# EAGLE design ext_m8 (EAGLE 4.13)
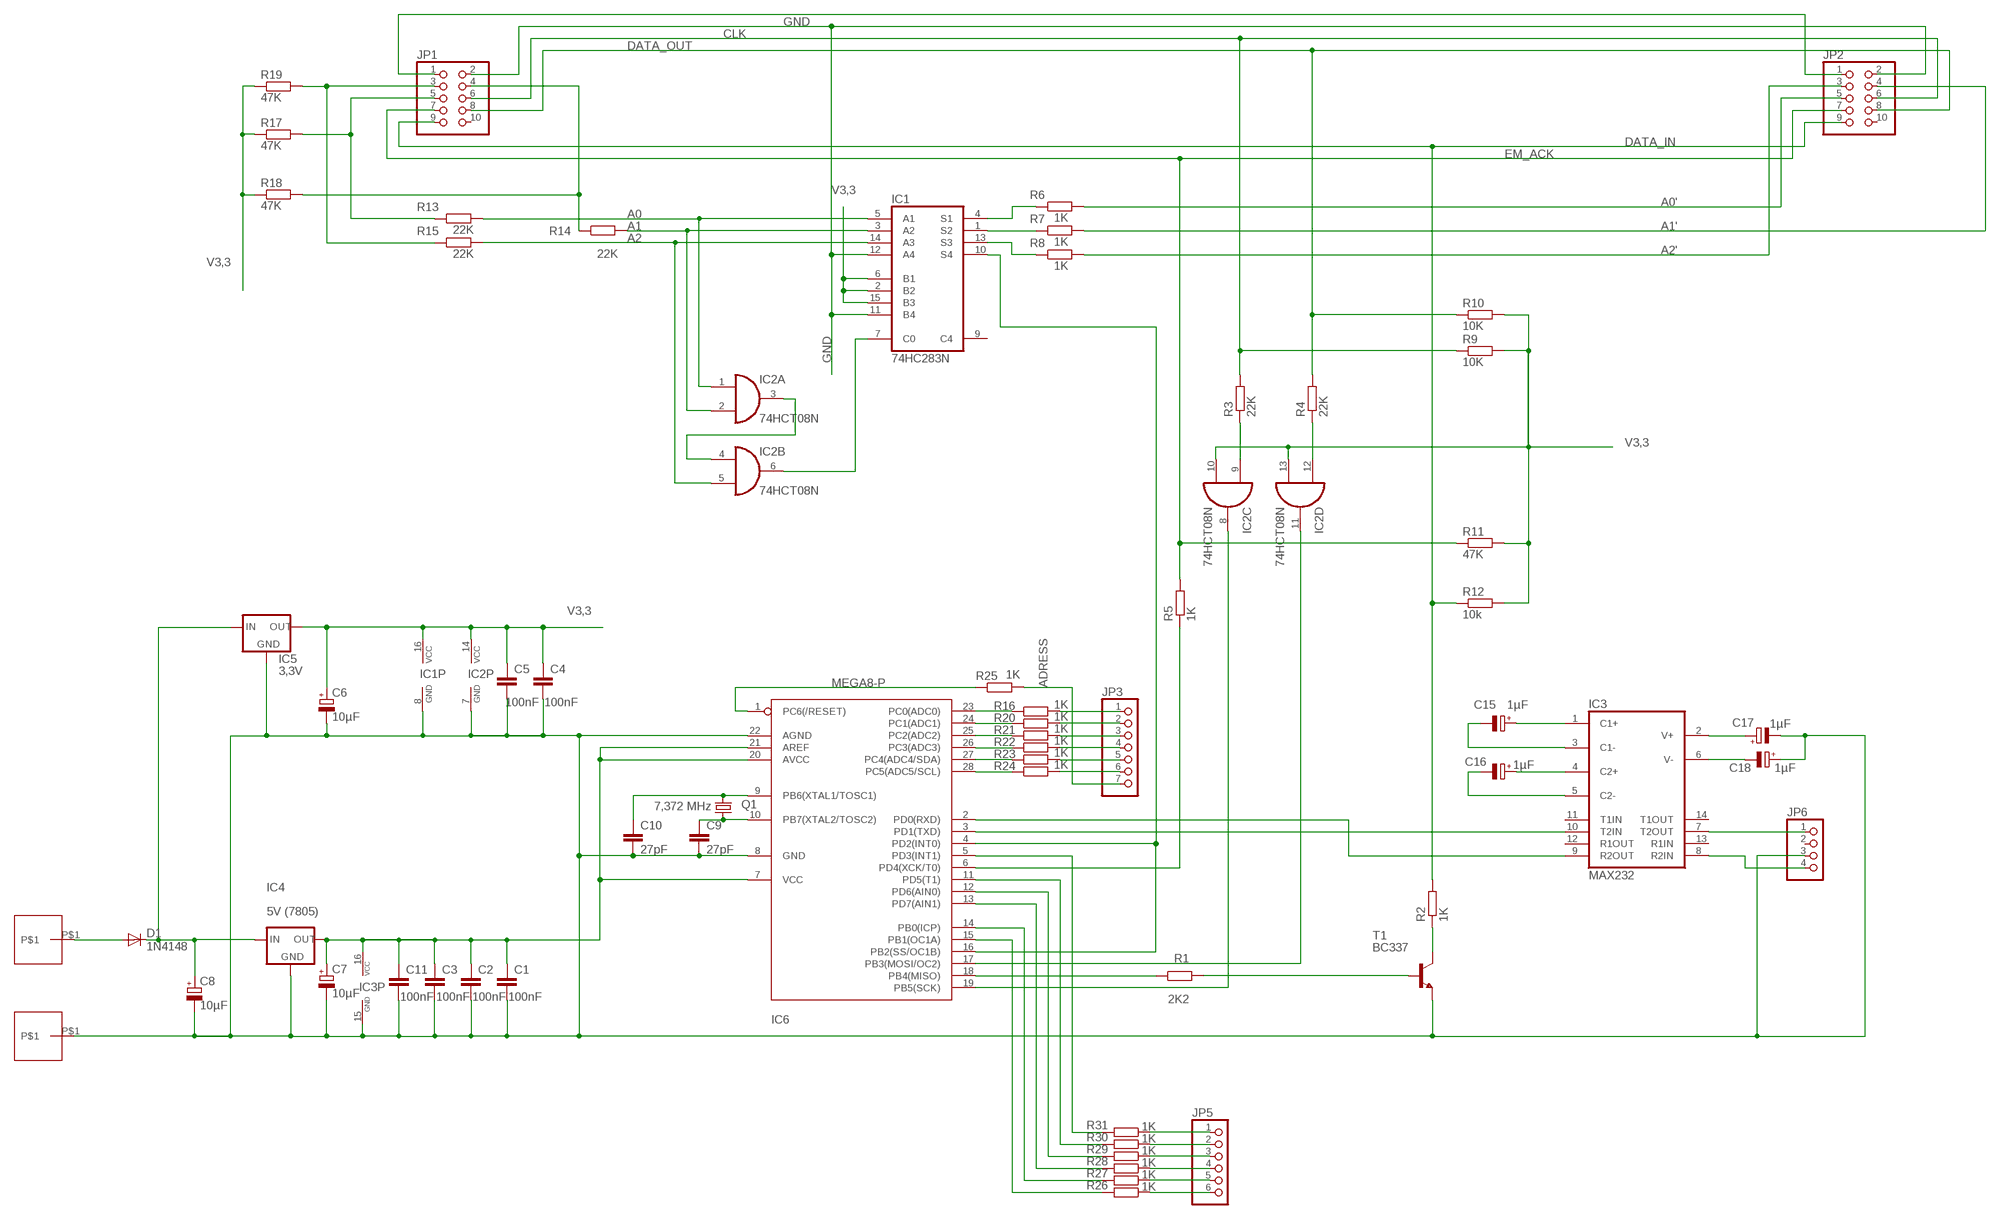
[diagram p0: schematic, sheet 1]

## Parts
C1  100nF  C-EU025-025X050  [C025-025X050]
C2  100nF  C-EU025-025X050  [C025-025X050]
C3  100nF  C-EU025-025X050  [C025-025X050]
C4  100nF  C-EU025-025X050  [C025-025X050]
C5  100nF  C-EU025-025X050  [C025-025X050]
C6  10µF  CPOL-EUE2,5-6E  [E2,5-6E]
C7  10µF  CPOL-EUE2,5-6E  [E2,5-6E]
C8  10µF  CPOL-EUE2,5-6E  [E2,5-6E]
C9  27pF  C-EU025-025X050  [C025-025X050]
C10  27pF  C-EU025-025X050  [C025-025X050]
C11  100nF  C-EU025-025X050  [C025-025X050]
C15  1µF  CPOL-EUE2.5-6  [E2,5-6]
C16  1µF  CPOL-EUE2.5-6  [E2,5-6]
C17  1µF  CPOL-EUE2.5-6  [E2,5-6]
C18  1µF  CPOL-EUE2.5-6  [E2,5-6]
D1  1N4148  [DO35-10]
IC1  74HC283N  74AC283N  [DIL16]
IC2  74HCT08N  74AC08N  [DIL14]
IC3  MAX232  [DIL16]
IC4  5V (7805)  78XXS  [78XXS]
IC5  3,3V  78XXS  [78XXS]
IC6  MEGA8-P  [DIL28-3]
JP1  PINHD-2X5W  [2X05/W]
JP2  PINHD-2X5W  [2X05/W]
JP3  PINHD-1X7  [1X07]
JP5  PINHD-1X6  [1X06]
JP6  PINHD-1X4  [1X04]
PIN1  FT-PIN2  [FT-PIN1]
PIN8  FT-PIN2  [FT-PIN1]
Q1  7,372 MHz  CRYTALHC49U-V  [HC49U-V]
R1  2K2  R-EU_0207/10  [0207/10]
R2  1K  R-EU_0207/10  [0207/10]
R3  22K  R-EU_0207/10  [0207/10]
R4  22K  R-EU_0207/10  [0207/10]
R5  1K  R-EU_0207/10  [0207/10]
R6  1K  R-EU_0207/10  [0207/10]
R7  1K  R-EU_0207/10  [0207/10]
R8  1K  R-EU_0207/10  [0207/10]
R9  10K  R-EU_0207/10  [0207/10]
R10  10K  R-EU_0207/10  [0207/10]
R11  47K  R-EU_0207/10  [0207/10]
R12  10k  R-EU_0207/10  [0207/10]
R13  22K  R-EU_0207/10  [0207/10]
R14  22K  R-EU_0207/10  [0207/10]
R15  22K  R-EU_0207/10  [0207/10]
R16  1K  R-EU_0207/2V  [0207/2V]
R17  47K  R-EU_0207/10  [0207/10]
R18  47K  R-EU_0207/10  [0207/10]
R19  47K  R-EU_0207/10  [0207/10]
R20  1K  R-EU_0207/2V  [0207/2V]
R21  1K  R-EU_0207/2V  [0207/2V]
R22  1K  R-EU_0207/2V  [0207/2V]
R23  1K  R-EU_0207/2V  [0207/2V]
R24  1K  R-EU_0207/2V  [0207/2V]
R25  1K  R-EU_0207/2V  [0207/2V]
R26  1K  R-EU_0207/2V  [0207/2V]
R27  1K  R-EU_0207/2V  [0207/2V]
R28  1K  R-EU_0207/2V  [0207/2V]
R29  1K  R-EU_0207/2V  [0207/2V]
R30  1K  R-EU_0207/2V  [0207/2V]
R31  1K  R-EU_0207/2V  [0207/2V]
T1  BC337  [TO92]

## Nets
A0: IC1.5(A1) IC2.1(A:I0) R13.2
A0': JP2.5 R6.2
A1: IC1.3(A2) IC2.2(A:I1) R14.2
A1': JP2.4 R7.2
A2: IC1.14(A3) IC2.5(B:I1) R15.2
A2': JP2.3 R8.2
ADRESS: IC1.10(S4) IC6.4(PD2(INT0)) IC6.16(PB2(SS/OC1B))
CLK: JP1.6 JP2.6 R3.2 R9.1
DATA_IN: JP1.9 JP2.9 R2.2 R12.1
DATA_OUT: JP1.8 JP2.8 R4.2 R10.1
EM_ACK: JP1.7 JP2.7 R5.2 R11.1
GND: C1.2 C2.2 C3.2 C4.2 C5.2 C6.- C7.- C8.- C9.2 C10.2 C11.2 C17.- C18.+ IC1.8(GND) IC1.11(B4) IC1.12(A4) IC2.7(P:GND) IC3.15(GND) IC4.GND IC5.GND IC6.8(GND) IC6.22(AGND) JP1.2 JP2.2 JP6.3 PIN1.P$1 T1.1(E)
N$1: IC2.3(A:O) IC2.4(B:I0)
N$2: IC6.18(PB4(MISO)) R1.1
N$3: IC1.7(C0) IC2.6(B:O)
N$4: R1.2 T1.2(B)
N$5: R2.1 T1.3(C)
N$6: C8.+ D1.C IC4.IN IC5.IN
N$7: JP1.5 R13.1 R17.2
N$8: IC2.9(C:I0) R3.1
N$9: IC2.12(D:I0) R4.1
N$10: JP1.1 JP2.1
N$11: IC6.6(PD4(XCK/T0)) R5.1
N$12: IC1.4(S1) R6.1
N$13: IC1.1(S2) R7.1
N$14: IC1.13(S3) R8.1
N$15: JP1.4 R14.1 R18.2
N$16: JP1.3 R15.1 R19.2
N$17: IC6.23(PC0(ADC0)) R16.1
N$18: D1.A PIN8.P$1
N$19: IC6.24(PC1(ADC1)) R20.1
N$20: IC6.25(PC2(ADC2)) R21.1
N$21: IC6.26(PC3(ADC3)) R22.1
N$22: IC6.27(PC4(ADC4/SDA)) R23.1
N$23: IC6.28(PC5(ADC5/SCL)) R24.1
N$24: C10.1 IC6.9(PB6(XTAL1/TOSC1)) Q1.2
N$25: C9.1 IC6.10(PB7(XTAL2/TOSC2)) Q1.1
N$26: IC6.15(PB1(OC1A)) R26.2
N$27: IC6.5(PD3(INT1)) R31.2
N$28: IC6.14(PB0(ICP)) R27.2
N$29: IC6.13(PD7(AIN1)) R28.2
N$30: IC6.12(PD6(AIN0)) R29.2
N$31: IC6.11(PD5(T1)) R30.2
N$32: JP3.1 R16.2
N$33: JP3.2 R20.2
N$34: IC6.1(PC6(/RESET)) R25.1
N$35: JP3.3 R21.2
N$36: JP3.4 R22.2
N$37: JP3.5 R23.2
N$38: JP3.6 R24.2
N$39: JP3.7 R25.2
N$40: JP5.6 R26.1
N$41: JP5.5 R27.1
N$42: JP5.4 R28.1
N$43: JP5.3 R29.1
N$44: JP5.2 R30.1
N$45: JP5.1 R31.1
N$46: C15.- IC3.3(C1-)
N$47: C15.+ IC3.1(C1+)
N$48: C16.- IC3.5(C2-)
N$49: C16.+ IC3.4(C2+)
N$50: C17.+ IC3.2(V+)
N$51: C18.- IC3.6(V-)
N$52: IC3.7(T2OUT) JP6.1
N$53: IC3.8(R2IN) JP6.4
N$54: IC2.8(C:O) IC6.19(PB5(SCK))
N$55: IC2.11(D:O) IC6.17(PB3(MOSI/OC2))
RXD: IC3.9(R2OUT) IC6.2(PD0(RXD))
TXD: IC3.10(T2IN) IC6.3(PD1(TXD))
V3,3: C4.1 C5.1 C6.+ IC1.2(B2) IC1.6(B1) IC1.15(B3) IC1.16(VCC) IC2.10(C:I1) IC2.13(D:I1) IC2.14(P:VCC) IC5.OUT R9.2 R10.2 R11.2 R12.2 R17.1 R18.1 R19.1
VCC: C1.1 C2.1 C3.1 C7.+ C11.1 IC3.16(VCC) IC4.OUT IC6.7(VCC) IC6.20(AVCC) IC6.21(AREF)
Unconnected: IC1.9(C4) IC3.11(T1IN) IC3.12(R1OUT) IC3.13(R1IN) IC3.14(T1OUT) JP1.10 JP2.10 JP6.2

## Library data of the parts
C1-C5 C9-C11 = rcl:C-EU: CAPACITOR, European symbol
C6-C8 C15-C18 = rcl:CPOL-EU: POLARIZED CAPACITOR, European symbol
D1 = diode:1N4148: DIODE high speed (Philips)
IC1 = 74xx-eu:74*283: 4-bit binary FULL ADDER, fast carry
IC2 = 74xx-eu:74*08: Quad 2-input AND gate
IC3 = maxim:MAX232: RS232 TRANSEIVER
IC4 IC5 = v-reg:78XXS: VOLTAGE REGULATOR
IC6 = atmel:MEGA8-P: MICROCONTROLLER 8 Kbytes FLASH 1 kbytes SRAM 512 bytes EEPROM USART 4-channel 10 bit ADC 2-channel 8 bit ADC
JP1 JP2 = pinhead:PINHD-2X5: PIN HEADER
JP3 = pinhead:PINHD-1X7: PIN HEADER
JP5 = pinhead:PINHD-1X6: PIN HEADER
JP6 = pinhead:PINHD-1X4: PIN HEADER
PIN1 PIN8 = thomas:FT-PIN
Q1 = crystal:CRYTAL: CRYSTAL
R1-R31 = rcl:R-EU_: RESISTOR, European symbol
T1 = transistor:BC337: NPN TRANSISTOR

## Board
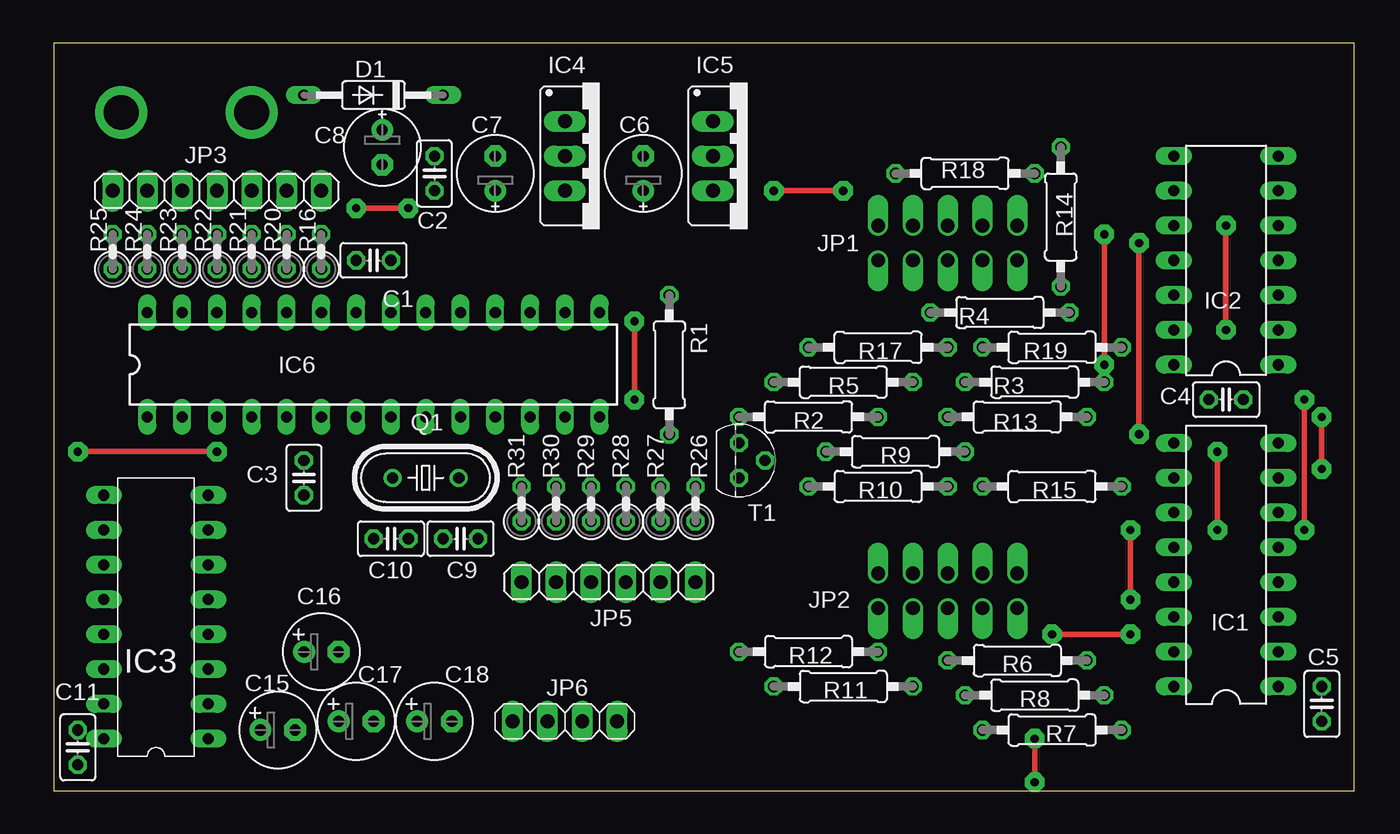
[diagram p1: board, top side]
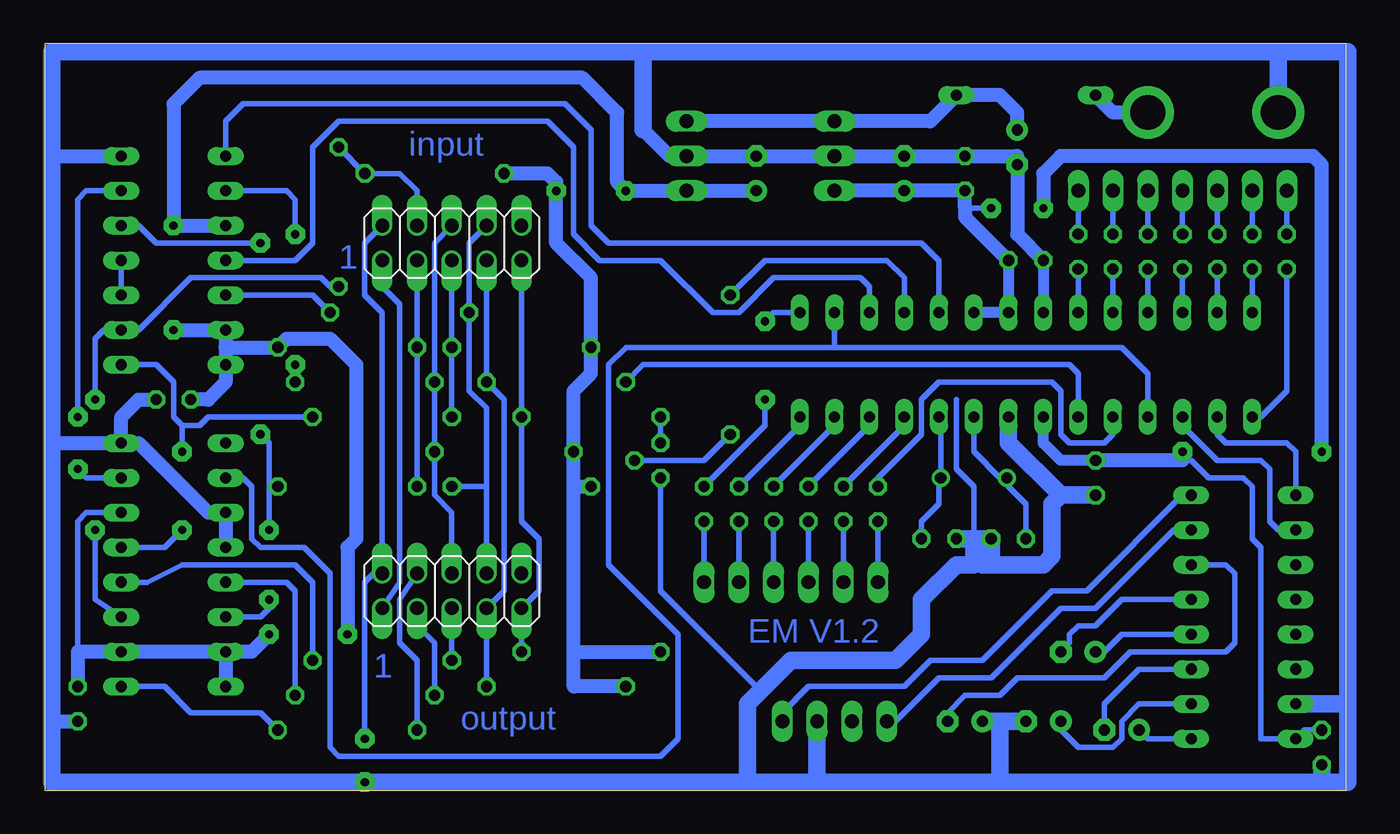
[diagram p2: board, bottom side, seen from below]

Size 94.92 x 54.6 mm. Coordinates in mm from the lower left corner, seen from the top.
Outline: 0,0 94.92,0 94.92,54.6 0,54.6 0,0
Copper layers (1*16): Top 0.035mm / dielectric 1.5mm / Bottom 0.035mm
Design rules "default": minimum track width 10mil, minimum drill 24mil, track to track 8mil, track to pad 8mil, pad to pad 8mil, via to via 8mil, smd to smd 8mil, copper to edge 40mil, drill to drill 8mil, minimum pad ring 10mil, minimum via ring 8mil, stop-mask expansion 4mil, vias tented up to drill 0mil, thermal gap 10mil

### Footprints (pad centres in the part's own frame; a part is rotated, then mirrored left to right if it is on the bottom)
C025-025X050 = drill 0.813 octagon: 1 -1.27,0; 2 1.27,0
E2,5-6E = drill 0.813 pad 1.575 round: + -1.27,0 | drill 0.813 pad 1.575 octagon: - 1.27,0
E2,5-6 = drill 0.813 pad 1.6 round: + -1.27,0 | drill 0.813 pad 1.6 octagon: - 1.27,0
DO35-10 = drill 0.813 long: A 5.08,0; C -5.08,0
DIL16 = drill 0.813 long: 1 -8.89,-3.81; 2 -6.35,-3.81; 3 -3.81,-3.81; 4 -1.27,-3.81; 5 1.27,-3.81; 6 3.81,-3.81; 7 6.35,-3.81; 8 8.89,-3.81; 9 8.89,3.81; 10 6.35,3.81; 11 3.81,3.81; 12 1.27,3.81; 13 -1.27,3.81; 14 -3.81,3.81; 15 -6.35,3.81; 16 -8.89,3.81
DIL14 = drill 0.813 long: 1 -7.62,-3.81; 2 -5.08,-3.81; 3 -2.54,-3.81; 4 0,-3.81; 5 2.54,-3.81; 6 5.08,-3.81; 7 7.62,-3.81; 8 7.62,3.81; 9 5.08,3.81; 10 2.54,3.81; 11 0,3.81; 12 -2.54,3.81; 13 -5.08,3.81; 14 -7.62,3.81
78XXS = drill 1.016 long: GND 0,-2.54; IN -2.54,-2.54; OUT 2.54,-2.54
DIL28-3 = drill 0.813 long: 1 -16.51,-3.81; 2 -13.97,-3.81; 3 -11.43,-3.81; 4 -8.89,-3.81; 5 -6.35,-3.81; 6 -3.81,-3.81; 7 -1.27,-3.81; 8 1.27,-3.81; 9 3.81,-3.81; 10 6.35,-3.81; 11 8.89,-3.81; 12 11.43,-3.81; 13 13.97,-3.81; 14 16.51,-3.81; 15 16.51,3.81; 16 13.97,3.81; 17 11.43,3.81; 18 8.89,3.81; 19 6.35,3.81; 20 3.81,3.81; 21 1.27,3.81; 22 -1.27,3.81; 23 -3.81,3.81; 24 -6.35,3.81; 25 -8.89,3.81; 26 -11.43,3.81; 27 -13.97,3.81; 28 -16.51,3.81
2X05/W = drill 1 offset: 1 -5.08,-1.27; 2 -5.08,1.27; 3 -2.54,-1.27; 4 -2.54,1.27; 5 0,-1.27; 6 0,1.27; 7 2.54,-1.27; 8 2.54,1.27; 9 5.08,-1.27; 10 5.08,1.27
1X07 = drill 1.016 long: 1 -7.62,0; 2 -5.08,0; 3 -2.54,0; 4 0,0; 5 2.54,0; 6 5.08,0; 7 7.62,0
1X06 = drill 1.016 long: 1 -6.35,0; 2 -3.81,0; 3 -1.27,0; 4 1.27,0; 5 3.81,0; 6 6.35,0
1X04 = drill 1.016 long: 1 -3.81,0; 2 -1.27,0; 3 1.27,0; 4 3.81,0
FT-PIN1 = drill 2.54 pad 3.81 round: P$1 0,0
HC49U-V = drill 0.813 round: 1 -2.413,0; 2 2.413,0
0207/10 = drill 0.813 octagon: 1 -5.08,0; 2 5.08,0
0207/2V = drill 0.813 octagon: 1 -1.27,0; 2 1.27,0
TO92 = drill 0.813 octagon: 1 1.27,0; 2 0,1.905; 3 -1.27,0

### Placement (x,y rotation side)
C1  23.33,38.73 180 top
C2  27.77,45.08 90 top
C3  18.25,22.86 270 top
C4  85.56,28.57 0 top
C5  92.55,6.34 270 top
C6  43.02,45.08 90 top
C7  32.22,45.08 90 top
C8  23.96,46.98 270 top
C9  29.68,18.41 180 top
C10  24.6,18.41 0 top
C11  1.74,3.17 270 top
C15  16.34,4.44 0 top
C16  19.52,10.16 0 top
C17  22.06,5.08 0 top
C18  27.77,5.08 0 top
D1  23.33,50.8 180 top
IC1  85.56,16.5 90 top
IC2  85.56,38.73 90 top
IC3  7.46,12.7 90 top
IC4  39.84,46.35 270 top
IC5  50.63,46.35 270 top
IC6  23.33,31.11 0 top
JP1  65.24,40 0 bottom
JP2  65.24,14.6 0 bottom
JP3  11.9,43.81 180 top
JP5  40.48,15.24 0 top
JP6  37.3,5.08 0 top
PIN1  4.92,49.53 0 top
PIN8  14.44,49.53 0 top
Q1  27.14,22.86 180 top
R1  44.92,31.11 270 top
R2  55.08,27.3 0 top
R3  71.59,29.84 180 top
R4  69.05,34.92 180 top
R5  57.62,29.84 0 top
R6  70.32,9.52 180 top
R7  72.86,4.44 180 top
R8  71.59,6.98 180 top
R9  61.43,24.76 180 top
R10  60.16,22.22 180 top
R11  57.62,7.62 180 top
R12  55.08,10.16 180 top
R13  70.32,27.3 0 top
R14  73.5,41.91 270 top
R15  72.86,22.22 0 top
R16  19.52,39.37 90 top
R17  60.16,32.38 0 top
R18  66.51,45.08 0 top
R19  72.86,32.38 180 top
R20  16.98,39.37 90 top
R21  14.44,39.37 90 top
R22  11.9,39.37 90 top
R23  9.36,39.37 90 top
R24  6.82,39.37 90 top
R25  4.28,39.37 90 top
R26  46.82,20.95 90 top
R27  44.28,20.95 90 top
R28  41.74,20.95 90 top
R29  39.2,20.95 90 top
R30  36.66,20.95 90 top
R31  34.12,20.95 90 top
T1  50,24.12 270 top

### Tracks (layer width: path | path; a pad name or v marks a point on that pad's centre or on a via)
A0  (via drill 0.6 pad 1.42)
  Top 0.406: v84.92,24.76 v84.92,19.04
  Bottom 0.406: R13.2 83.02,27.3 83.66,26.66 84.92,26.66 | 84.92,26.66 85.56,27.3 85.56,29.84 86.83,31.11 IC2.1 | IC1.5 86.19,17.77 v84.92,19.04 | 84.92,26.66 v84.92,24.76
A0'
  Bottom 0.406: R6.2 JP2.5
A1  (via drill 0.6 pad 1.42)
  Top 0.406: v91.28,19.04 v91.28,28.57
  Bottom 0.406: R14.2 74.13,36.83 74.77,37.46 84.29,37.46 88.1,33.65 IC2.2 | IC2.2 90,33.65 | IC1.3 91.28,13.97 v91.28,19.04 | v91.28,28.57 91.28,33.02 90.64,33.65 IC2.2
A1'
  Bottom 0.406: R7.2 67.78,9.52 69.05,10.79 69.05,13.97 JP2.4
A2  (via drill 0.6 pad 1.42)
  Top 0.406: v79.21,26.03 v79.21,40 | v78.58,13.97 v78.58,19.04
  Bottom 0.406: v78.58,13.97 78.58,13.33 79.21,12.7 IC1.14 | v79.21,40 86.83,40 88.1,41.27 IC2.5 | 78.58,22.22 78.58,25.39 v79.21,26.03 | v78.58,19.04 78.58,22.22 | 78.58,22.22 R15.2
A2'
  Bottom 0.406: R8.2 66.51,10.79 67.78,12.06 JP2.3
ADRESS
  Bottom 0.406: IC6.4 14.44,30.47 16.34,32.38 37.3,32.38 | IC6.16 37.3,33.65 37.3,32.38 | 37.3,32.38 52.54,32.38 53.81,31.11 53.81,16.5 48.73,11.43 48.73,3.8 50,2.54 73.5,2.54 74.13,3.17 74.13,15.87 76.03,17.77 79.21,17.77 79.84,18.41 79.84,22.22 80.48,22.86 IC1.10
CLK
  Bottom 0.406: JP2.6 65.24,20.31 66.51,21.58 R9.1 R3.2 66.51,40 JP1.6
DATA_IN
  Bottom 0.406: JP1.9 R2.2 60.16,19.68 58.89,18.41 58.89,14.6 JP2.9 R12.1
DATA_OUT
  Bottom 0.406: JP2.8 62.7,22.22 | 62.7,22.22 R10.1 | 62.7,22.22 62.7,27.93 63.97,29.2 R4.2 63.97,40 JP1.8
EM_ACK
  Bottom 0.406: JP1.7 R5.2 61.43,28.57 61.43,14.6 JP2.7 R11.1
GND  (via drill 0.6 pad 1.42)
  Top 0.406: v71.59,0.63 v71.59,3.8
  Bottom 0.406: 27.14,17.77 27.14,18.41 27.14,22.22 28.41,23.49 28.41,28.57 | T1.1 50,14.6 42.7,7.3 | JP1.2 71.59,40 71.59,36.19 70.32,34.92 JP2.2 70.95,15.87 71.59,15.24 v71.59,3.8 | 49.37,46.35 IC5.GND
  Bottom 0.813: C1.2 IC6.22
  Bottom 1.016: 51.27,48.26 49.37,46.35 | IC5.GND C6.- IC4.GND C7.- C2.2 23.96,46.35 C8.- 23.96,40.64 C1.2 | 94.45,46.35 IC2.7 | 94.45,25.39 IC1.8 | IC1.12 IC1.11 83.02,20.31 88.1,25.39 IC1.8 | C4.2 88.1,28.57 89.37,27.3 IC1.8 | 94.45,5.08 C5.2
  Bottom 1.27: 1.74,0.63 -0.17,0.63 -0.17,6.34 | 1.74,0.63 25.23,0.63 | 25.23,0.63 38.57,0.63 | 38.57,0.63 43.65,0.63 | 43.65,0.63 v71.59,0.63 94.45,0.63 94.45,5.08 94.45,25.39 94.45,46.35 94.45,53.97 51.27,53.97 | -0.17,6.34 -0.17,53.97 4.92,53.97 | 4.92,53.97 51.27,53.97 | 51.27,53.97 51.27,48.26 | 25.23,5.08 C17.- | 25.23,5.08 C18.+ | 20.79,21.58 C3.2 | 20.79,21.58 24.6,25.39 IC6.8 | C11.2 1.74,0.63 | -0.17,6.34 IC3.15 | 38.57,0.63 JP6.3 | C9.2 27.14,18.41 C10.2 25.87,17.14 26.5,16.5 22.06,16.5 21.42,17.14 21.42,20.95 20.79,21.58 | 27.14,17.77 27.14,16.5 28.41,16.5 30.95,13.97 30.95,11.43 32.85,9.52 40.48,9.52 42.7,7.3 43.65,6.34 43.65,0.63 | 4.92,53.97 PIN1.P$1 | 25.23,0.63 25.23,5.08
N$1
  Bottom 0.406: IC2.3 IC2.4
N$2
  Bottom 0.406: IC6.18 32.22,37.46 33.49,38.73 42.38,38.73 R1.1
N$3  (via drill 0.6 pad 1.42)
  Top 0.406: v92.55,23.49 v92.55,27.3
  Bottom 0.406: IC2.6 91.91,43.81 92.55,43.18 v92.55,27.3 | v92.55,23.49 91.91,22.86 IC1.7
N$4
  Bottom 0.406: T1.2 46.82,24.12 R1.2
N$5
  Bottom 0.406: T1.3 R2.1
N$6
  Bottom 1.016: IC5.IN IC4.IN 30.31,48.89 D1.C 25.23,50.8 23.96,49.53 C8.+
N$7
  Bottom 0.406: JP1.5 R17.2 R13.1
N$8  (via drill 0.6 pad 1.42)
  Top 0.406: v76.67,31.11 v76.67,40.64
  Bottom 0.406: R3.1 v76.67,31.11 | v76.67,40.64 76.67,43.18 77.3,43.81 IC2.9
N$9
  Bottom 0.406: R4.1 75.4,36.19 IC2.12
N$10
  Bottom 0.406: JP2.1 69.05,15.24 69.05,35.55 70.32,36.83 JP1.1
N$11
  Bottom 0.406: IC6.6 19.52,30.47 20.15,31.11 51.27,31.11 R5.1
N$12
  Bottom 0.406: R6.1 75.4,15.24 76.67,16.5 84.92,16.5 87.47,15.24 IC1.4
N$13
  Bottom 0.406: R7.1 79.21,5.71 84.29,5.71 86.19,7.62 IC1.1
N$14
  Bottom 0.406: R8.1 76.67,14.6 77.3,15.24 IC1.13
N$15
  Bottom 0.406: JP1.4 67.78,43.81 69.05,45.08 R18.2 R14.1
N$16
  Bottom 0.406: JP1.3 R19.2 R15.1
N$17
  Bottom 0.406: IC6.23 R16.1
N$18
  Bottom 1.016: PIN8.P$1 16.98,49.53 D1.A
N$19
  Bottom 0.406: IC6.24 R20.1
N$20
  Bottom 0.406: IC6.25 R21.1
N$21
  Bottom 0.406: IC6.26 R22.1
N$22
  Bottom 0.406: IC6.27 R23.1
N$23
  Bottom 0.406: IC6.28 R24.1
N$24
  Bottom 0.406: IC6.9 27.14,24.76 25.23,22.86 Q1.2 24.73,22.35 23.33,20.95 C10.1
N$25
  Bottom 0.406: IC6.10 29.55,27.17 Q1.1 29.68,22.86 29.68,20.95 30.95,19.68 C9.1
N$26  (via drill 0.6 pad 1.42)
  Top 0.406: v42.38,28.57 v42.38,34.29
  Bottom 0.406: R26.2 42.38,26.66 v42.38,28.57 | IC6.15 41.74,34.92 v42.38,34.29
N$27
  Bottom 0.406: IC6.5 16.98,26.03 17.61,25.39 20.15,25.39 20.79,26.03 20.79,29.2 21.42,29.84 29.68,29.84 30.95,28.57 30.95,26.03 34.12,22.86 R31.2
N$28
  Bottom 0.406: IC6.14 39.84,26.66 R27.2
N$29
  Bottom 0.406: IC6.13 37.3,26.66 R28.2
N$30
  Bottom 0.406: R29.2 34.76,26.66 IC6.12
N$31
  Bottom 0.406: IC6.11 32.22,26.66 R30.2
N$32
  Bottom 0.406: R16.2 JP3.1
N$33
  Bottom 0.406: R20.2 JP3.2
N$34
  Bottom 0.406: IC6.1 6.18,27.3 4.28,29.2 R25.1
N$35
  Bottom 0.406: R21.2 JP3.3
N$36
  Bottom 0.406: R22.2 JP3.4
N$37
  Bottom 0.406: R23.2 JP3.5
N$38
  Bottom 0.406: R24.2 JP3.6
N$39
  Bottom 0.406: R25.2 JP3.7
N$40
  Bottom 0.406: JP5.6 R26.1
N$41
  Bottom 0.406: JP5.5 R27.1
N$42
  Bottom 0.406: JP5.4 R28.1
N$43
  Bottom 0.406: JP5.3 R29.1
N$44
  Bottom 0.406: JP5.2 R30.1
N$45
  Bottom 0.406: JP5.1 R31.1
N$46
  Bottom 0.406: C15.- 17.61,6.34 15.08,8.89 IC3.3
N$47
  Bottom 0.406: IC3.1 14.44,3.8 C15.+
N$48
  Bottom 0.406: IC3.5 16.34,13.97 18.25,12.06 19.52,12.06 20.15,11.43 20.15,10.79 C16.-
N$49
  Bottom 0.406: IC3.4 16.34,11.43 17.61,10.16 C16.+
N$50
  Bottom 0.406: IC3.2 15.08,6.34 16.34,5.08 16.34,3.8 16.98,3.17 19.52,3.17 20.79,4.44 C17.+
N$51
  Bottom 0.406: IC3.6 8.73,16.5 8.09,15.87 8.09,10.79 8.73,10.16 15.71,10.16 17.61,8.25 23.96,8.25 25.23,6.98 27.77,6.98 29.04,5.71 C18.-
N$52
  Bottom 0.406: IC3.7 12.54,19.04 18.25,13.33 20.79,13.33 25.87,8.25 29.68,8.25 32.85,5.08 JP6.1
N$53
  Bottom 0.406: IC3.8 11.9,21.58 18.88,14.6 21.42,14.6 26.5,9.52 30.31,9.52 32.22,7.62 39.2,7.62 41.11,5.71 JP6.4
N$54
  Bottom 0.406: IC6.19 29.68,38.73 30.95,40 53.81,40 55.08,41.27 55.08,48.26 56.98,50.16 80.48,50.16 81.75,48.89 IC2.8
N$55
  Bottom 0.406: IC6.17 34.76,36.83 35.39,37.46 41.74,37.46 44.28,34.92 46.19,34.92 50,38.73 54.45,38.73 56.35,40.64 56.35,46.98 58.25,48.89 73.5,48.89 75.4,46.98 75.4,40 76.67,38.73 IC2.11
RXD
  Bottom 0.406: IC3.9 3.64,24.76 4.28,25.39 8.73,25.39 9.36,26.03 IC6.2
TXD
  Bottom 0.406: IC6.3 11.9,26.66 9.36,24.12 6.18,24.12 5.55,23.49 5.55,19.68 4.92,19.04 IC3.10
V3,3  (via drill 0.6 pad 1.42)
  Top 0.406: v85.56,41.27 v85.56,33.65 | v57.62,43.81 v52.54,43.81 | v72.86,11.43 v78.58,11.43
  Bottom 0.406: IC1.6 91.91,20.31 92.55,19.68 92.55,10.16
  Bottom 1.016: C6.+ IC5.OUT v52.54,43.81 53.17,44.45 53.17,49.53 55.71,52.07 83.66,52.07 85.56,50.16 v85.56,41.27 IC2.10 | 56.35,22.22 R9.2 56.35,29.2 55.08,30.47 R17.1 55.08,37.46 57.62,40 v57.62,43.81 57.62,44.45 58.25,45.08 R18.1 | 56.35,22.22 R10.2 | 56.35,10.16 56.35,22.22 | 56.35,10.16 R12.2 | R11.2 56.35,7.62 56.35,10.16 | 81.75,32.38 R19.1 77.3,33.02 74.13,33.02 72.22,31.11 72.22,18.41 72.86,17.77 v72.86,11.43 | 81.75,32.38 IC2.14 81.75,29.84 83.02,28.57 C4.1 | 81.75,32.38 IC2.13 v85.56,33.65 | IC1.15 IC1.2 92.55,10.16 C5.1 | IC1.15 IC1.16 | IC1.15 79.84,10.16 v78.58,11.43
VCC  (via drill 0.6 pad 1.42)
  Top 0.406: v22.06,42.54 v25.87,42.54 | v11.9,24.76 v1.74,24.76
  Bottom 0.406: 11.9,24.12 11.27,24.12 10,22.86 7.46,22.86 6.82,22.22 6.82,18.41 6.18,17.77 6.18,3.8 IC3.16 3.01,4.44 C11.1 | v25.87,42.54 27.77,42.54
  Bottom 0.813: C1.1 IC6.21 IC6.20 | C3.1 20.79,24.12 22.06,25.39 IC6.7
  Bottom 1.016: IC4.OUT C7.+ C2.1 27.77,42.54 27.77,41.91 C1.1 | C3.1 11.9,24.12 v11.9,24.76 | v1.74,24.76 1.74,45.72 2.38,46.35 20.79,46.35 22.06,45.08 v22.06,42.54

### Text on the board
Bottom: input | 1 | EM V1.2 | 1 | output